# Altium schematic sheet SAMC21_Xplained_Pro_Arduino_Connectors.SchDoc: Arduino Uno interface connectors
size A3; Organization: ATMEL Norway; Address1: Vestre Rosten 79; Address2: N-7075 TILLER; Address3: NORWAY; DocumentNumber: A09-2419; Revision: 2; SheetNumber: 7; SheetTotal: 9; PageSetup: Record=PageOptions|CenterHorizontal=True|CenterVertical=True|PrintScale=1.01|XCorrection=1.00|YCorrection=1.00|PrintKind=1|BorderSize=5000000|LeftOffset=0|BottomOffset=0|Orientation=2|PaperLength=1000|PaperWidth=1000|Scale=100|PaperSource=7|PrintQuality=-4|MediaType=1|DitherType=10|PaperKind=A3 (297 x 420 mm)|PrintScaleMode=1
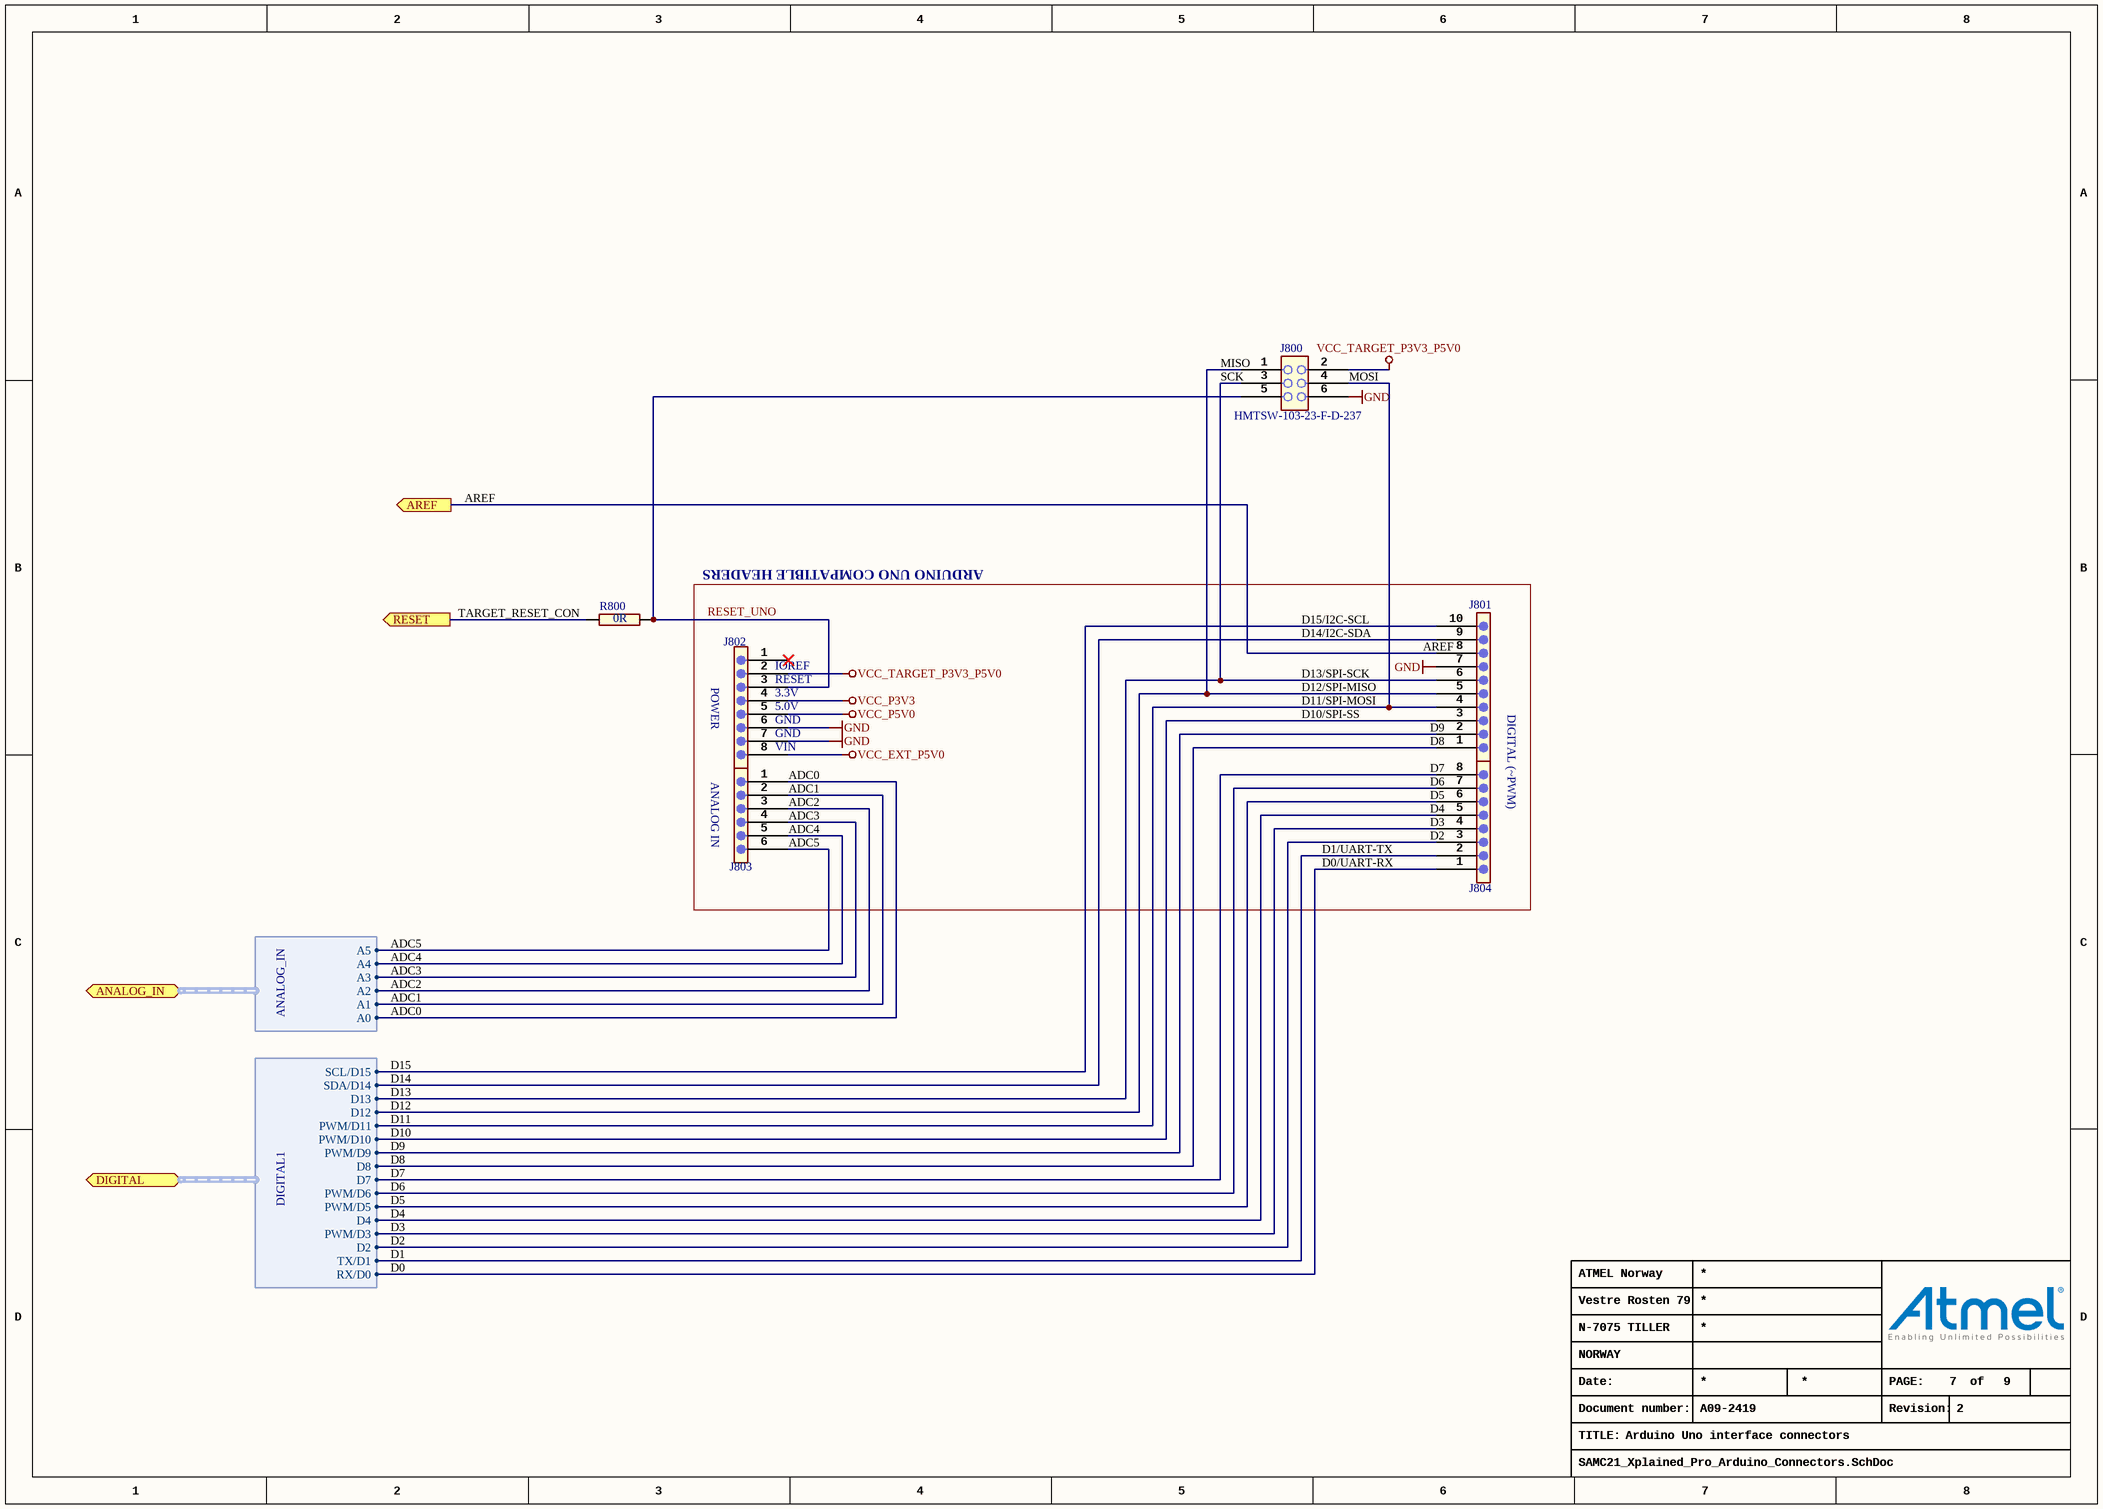
[diagram p0: SAMC21_Xplained_Pro_Arduino_Connectors.SchDoc]

## Parts
J800  value HMTSW-103-23-F-D-237  [AP8-00182]  (hidden comment: HEADER 2x3)
J801  HEADER 1x10 FEMALE  [AP8-00822]  (value not drawn)
J802  HEADER 1x8 FEMALE  [AP8-00823]  (value not drawn)
J803  HEADER 1x6 FEMALE  [AP8-00824]  (value not drawn)
J804  HEADER 1x8 FEMALE  [AP8-00823]  (value not drawn)
R800  value 0R  [AP2-00000]  (hidden comment: R2)

## Blocks framed on the sheet
ARDUINO UNO COMPATIBLE HEADERS: J801-J804

## Ports
ANALOG_IN (harness ANALOG_IN), AREF (out), DIGITAL (harness DIGITAL1), RESET (out)

## Harnesses
ANALOG_IN: A0, A1, A2, A3, A4, A5
DIGITAL1: RX/D0, TX/D1, D2, PWM/D3, D4, PWM/D5, PWM/D6, D7, D8, PWM/D9, PWM/D10, PWM/D11, D12, D13, SDA/D14, SCL/D15

## Nets
GND: J800.6 J801.7 J802.6 J802.7
VCC_EXT_P5V0: J802.8
VCC_P3V3: J802.4
VCC_P5V0: J802.5
VCC_TARGET_P3V3_P5V0: J800.2 J802.2
AREF: J801.8 ; port AREF
RESET: R800.1 ; port RESET
RESET_UNO: J800.5 J802.3 R800.2
NetJ800_1: J800.1 J801.5 ; port DIGITAL.D12
NetJ800_3: J800.3 J801.6 ; port DIGITAL.D13
NetJ800_4: J800.4 J801.4 ; port DIGITAL.PWM/D11
NetJ801_1: J801.1 ; port DIGITAL.D8
NetJ801_2: J801.2 ; port DIGITAL.PWM/D9
NetJ801_3: J801.3 ; port DIGITAL.PWM/D10
NetJ801_9: J801.9 ; port DIGITAL.SDA/D14
NetJ801_10: J801.10 ; port DIGITAL.SCL/D15
NetJ803_1: J803.1 ; port ANALOG_IN.A0
NetJ803_2: J803.2 ; port ANALOG_IN.A1
NetJ803_3: J803.3 ; port ANALOG_IN.A2
NetJ803_4: J803.4 ; port ANALOG_IN.A3
NetJ803_5: J803.5 ; port ANALOG_IN.A4
NetJ803_6: J803.6 ; port ANALOG_IN.A5
NetJ804_1: J804.1 ; port DIGITAL.RX/D0
NetJ804_2: J804.2 ; port DIGITAL.TX/D1
NetJ804_3: J804.3 ; port DIGITAL.D2
NetJ804_4: J804.4 ; port DIGITAL.PWM/D3
NetJ804_5: J804.5 ; port DIGITAL.D4
NetJ804_6: J804.6 ; port DIGITAL.PWM/D5
NetJ804_7: J804.7 ; port DIGITAL.PWM/D6
NetJ804_8: J804.8 ; port DIGITAL.D7

Not connected (* = marked no-connect by the designer): J802 1*

## Notes on the sheet
- (near J800) MISO
- (near J800) SCK
- (near J800) MOSI
- AREF
- (near R800) TARGET_RESET_CON
- D14/I2C-SDA
- D15/I2C-SCL
- (near J801) AREF
- (near J802) POWER
- (near J802) IOREF
- (near J802) RESET
- (near J802) 3.3V
- (near J802) 5.0V
- (near J802) GND
- D10/SPI-SS
- D11/SPI-MOSI
- D12/SPI-MISO
- D13/SPI-SCK
- D9
- DIGITAL (~PWM)
- ANALOG IN
- VIN
- ADC0
- ADC1
- D6
- D7
- D8
- ADC2
- (near J803) ADC3
- (near J803) ADC4
- (near J803) ADC5
- D0/UART-RX
- D1/UART-TX
- (near J804) D2
- (near J804) D3
- (near J804) D4
- D5
- ADC3
- ADC4
- ADC5
- D10
- D11
- D12
- D13
- D14
- D15
- D0
- D1
- D2
- D3
- D4
- Date:
- PAGE:
- of
- TITLE:
- Document number:
- Revision:

## Library data of the parts
J800 = A08-1654: 2x3 pin header, 2.54mm pitch, Pin-in-Paste THM; PartGroup: Mechanical devices,Connectors,Pin headers; Manufacturer: SAMTEC; TemperatureRange: - 55 ï¿½C to + 125 ï¿½C; AN: A08-1654; Height: 6,09999990463257; MPN: HMTSW-103-23-F-D-237
J801 = A08-2026: 1x10 receptacle pin header, low insertion force, 2.54mm pitch THM, Pin in Paste; PartGroup: Mechanical devices,Connectors,Pin header receptacle; Manufacturer: SAMTEC; Value: SSQ-110-21-F-S; AN: A08-2026; Height: 8,51000022888184; MPN: SSQ-110-21-F-S
J802 J804 = A08-2025: 1x8 receptacle pin header, low insertion force, 2.54mm pitch THM, Pin in Paste; PartGroup: Mechanical devices,Connectors,Pin header receptacle; Manufacturer: SAMTEC; Value: SSQ-108-21-F-S; AN: A08-2025; Height: 8,51000022888184; MPN: SSQ-108-21-F-S
J803 = A08-2024: 1x6 receptacle pin header, low insertion force, 2.54mm pitch THM; PartGroup: Mechanical devices,Connectors,Pin header receptacle; Manufacturer: SAMTEC; Value: SSQ-106-21-F-S; AN: A08-2024; Height: 8,51000022888184; MPN: SSQ-106-21-F-S
R800 = A02-0163: RES 0.0 OHM 1/16W 0402 SMD; PartGroup: Resistors,SMD,0402 1%; Manufacturer: (n/a); MPN: RMCF0402ZT0R00; Tolerance: 1 %; TemperatureRange: -55 - +125 deg C; AN: A02-0163; Height: 0.349999994039536